# EAGLE schematic energia-2 (EAGLE 6.1)

## Sheet 1 of 4: Base
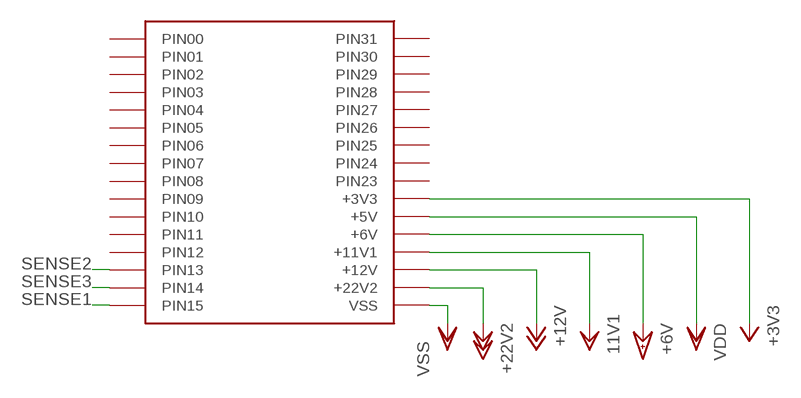
[diagram p0: schematic, sheet 1]

### Parts
U$1  BASE  [BASE]

### Nets
+3V3: U$1.PIN22(+3V3) ; also sheet 3
+6V: U$1.PIN20(+6V) ; also sheet 2
+11V1: U$1.PIN19(+11V1) ; supply symbol labelled 11V1 ; also sheet 3
+12V: U$1.PIN18(+12V) ; also sheet 2
+22V: U$1.PIN17(+22V2) ; supply symbol labelled +22V2 ; also sheet 2
SENSE1: U$1.PIN15 ; also sheet 4
SENSE2: U$1.PIN13 ; also sheet 4
SENSE3: U$1.PIN14 ; also sheet 4
VDD: U$1.PIN21(+5V) ; also sheet 3,4
VSS: U$1.PIN16(VSS) ; also sheet 2,3,4
Unconnected: U$1.PIN00 U$1.PIN01 U$1.PIN02 U$1.PIN03 U$1.PIN04 U$1.PIN05 U$1.PIN06 U$1.PIN07 U$1.PIN08 U$1.PIN09 U$1.PIN10 U$1.PIN11 U$1.PIN12 U$1.PIN23 U$1.PIN24 U$1.PIN25 U$1.PIN26 U$1.PIN27 U$1.PIN28 U$1.PIN29 U$1.PIN30 U$1.PIN31

## Sheet 2 of 4: Actuadores
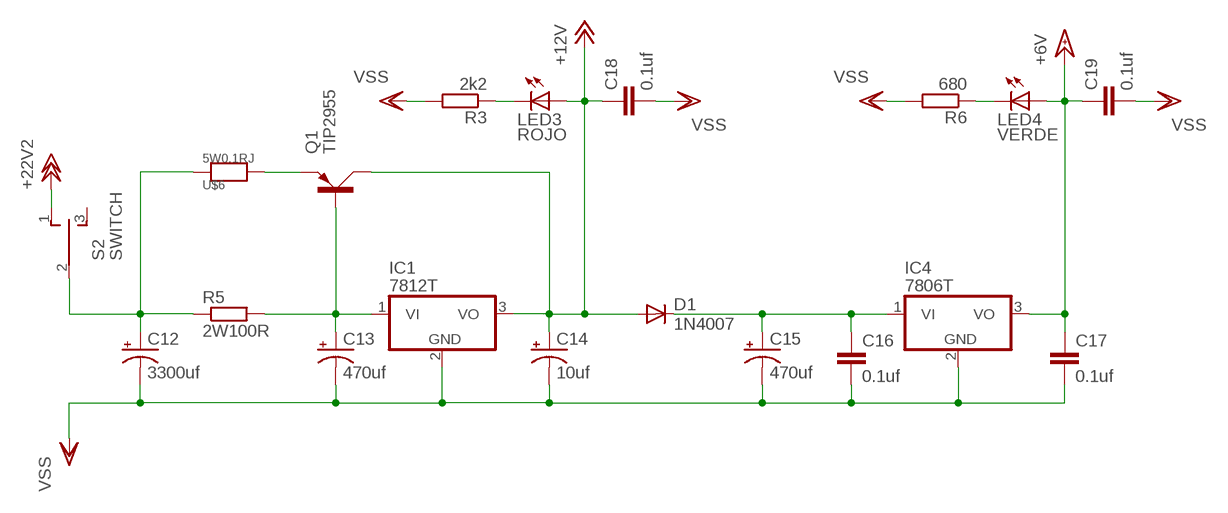
[diagram p1: schematic, sheet 2]

### Parts
C12  3300uf  CPOL-USE7.5-18  [E7,5-18]
C13  470uf  CPOL-USE3.5-8  [E3,5-8]
C14  10uf  CPOL-USE2.5-5  [E2,5-5]
C15  470uf  CPOL-USE3.5-8  [E3,5-8]
C16  0.1uf  C-EU050-024X044  [C050-024X044]
C17  0.1uf  C-EU050-024X044  [C050-024X044]
C18  0.1uf  C-EU050-024X044  [C050-024X044]
C19  0.1uf  C-EU050-024X044  [C050-024X044]
D1  1N4007  1N4004  [DO41-10]
IC1  7812T  [TO220H]
IC4  7806T  [TO220H]
LED3  ROJO  LED3MM  [LED3MM]
LED4  VERDE  LED3MM  [LED3MM]
Q1  TIP2955  [TOP3AV]
R3  2k2  R-EU_0204/5  [0204/5]
R5  2W100R  R-EU_0411/12  [0411/12]
R6  680  R-EU_0204/5  [0204/5]
S2  SWITCH  TL39YOSWITCH_2_ESTADOS  [TL3XYO]
U$6  5W0.1RJ  RESISTENCIA5WATT  [RES-22X10]

### Nets
+6V: C17.1 C19.1 IC4.3(VO) LED4.A ; also sheet 1
+12V: C14.+ C18.1 D1.A IC1.3(VO) LED3.A Q1.C ; also sheet 1
+22V: S2.1(O) ; supply symbol labelled +22V2 ; also sheet 1
N$3: LED3.K(C) R3.1
N$4: C12.+ R5.1 S2.2(P) U$6.P$1
N$7: Q1.E U$6.P$2
N$8: C13.+ IC1.1(VI) Q1.B R5.2
N$9: LED4.K(C) R6.1
N$13: C15.+ C16.1 D1.C IC4.1(VI)
VSS: C12.- C13.- C14.- C15.- C16.2 C17.2 C18.2 C19.2 IC1.2(GND) IC4.2(GND) R3.2 R6.2 ; also sheet 1,3,4
Unconnected: S2.3(S)

## Sheet 3 of 4: Energia Nucleo
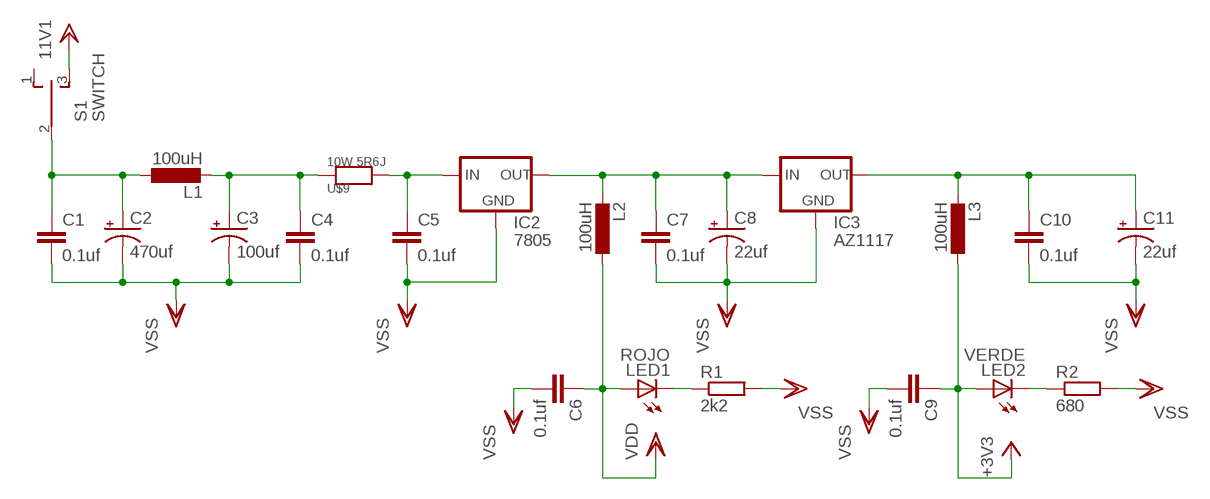
[diagram p2: schematic, sheet 3]

### Parts
C1  0.1uf  C-EU050-024X044  [C050-024X044]
C2  470uf  CPOL-USE2.5-7  [E2,5-7]
C3  100uf  CPOL-USE2.5-7  [E2,5-7]
C4  0.1uf  C-EU050-024X044  [C050-024X044]
C5  0.1uf  C-EU050-024X044  [C050-024X044]
C6  0.1uf  C-EU050-024X044  [C050-024X044]
C7  0.1uf  C-EU050-024X044  [C050-024X044]
C8  22uf  CPOL-USE2.5-7  [E2,5-7]
C9  0.1uf  C-EU050-024X044  [C050-024X044]
C10  0.1uf  C-EU050-024X044  [C050-024X044]
C11  22uf  CPOL-USE2.5-7  [E2,5-7]
IC2  7805  V_REG_78XX-TO-220  [TO-220-ALT]
IC3  AZ1117  V_REG_LD1117VXX  [78XXL]
L1  100uH  L-EUTFI0307  [TFI0307]
L2  100uH  L-EU0207/7  [0207/7]
L3  100uH  L-EU0207/7  [0207/7]
LED1  ROJO  LED3MM  [LED3MM]
LED2  VERDE  LED3MM  [LED3MM]
R1  2k2  R-EU_0204/5  [0204/5]
R2  680  R-EU_0204/5  [0204/5]
S1  SWITCH  TL39YOSWITCH_2_ESTADOS  [TL3XYO]
U$9  10W 5R6J  RESISTENCIA10W  [RES-49X10]

### Nets
+3V3: C9.1 L3.1 LED2.A ; also sheet 1
+11V1: S1.3(S) ; supply symbol labelled 11V1 ; also sheet 1
N$1: C1.1 C2.+ L1.1 S1.2(P)
N$10: C5.1 IC2.IN U$9.P$2
N$11: C3.+ C4.1 L1.2 U$9.P$1
N$12: C7.1 C8.+ IC2.OUT IC3.OUT(IN) L2.2
N$14: LED1.K(C) R1.1
N$17: C10.1 C11.+ IC3.GND(OUT) L3.2
N$18: LED2.K(C) R2.1
VDD: C6.1 L2.1 LED1.A ; also sheet 1,4
VSS: C1.2 C2.- C3.- C4.2 C5.2 C6.2 C7.2 C8.- C9.2 C10.2 C11.- IC2.GND IC3.IN(GND) R1.2 R2.2 ; also sheet 1,2,4
Unconnected: S1.1(O)

## Sheet 4 of 4: Monitor Lipo
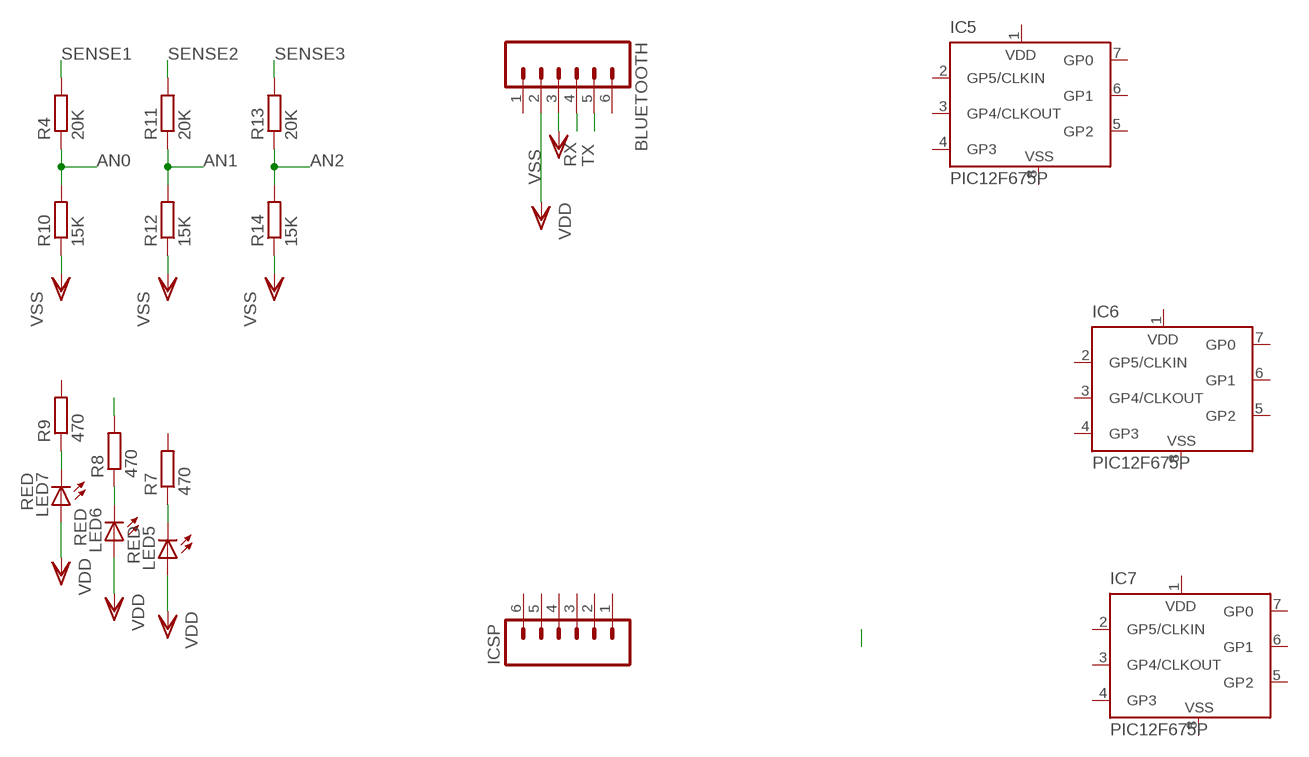
[diagram p3: schematic, sheet 4]

### Parts
BLUETOOTH  M06LONGPADS  [1X06_LONGPADS]
IC5  PIC12F675P  [DIL8]
IC6  PIC12F675P  [DIL8]
IC7  PIC12F675P  [DIL8]
ICSP  M06LONGPADS  [1X06_LONGPADS]
LED5  RED  LED3MM  [LED3MM]
LED6  RED  LED3MM  [LED3MM]
LED7  RED  LED3MM  [LED3MM]
R4  20K  R-EU_0204/5  [0204/5]
R7  470  R-EU_0204/5  [0204/5]
R8  470  R-EU_0204/5  [0204/5]
R9  470  R-EU_0204/5  [0204/5]
R10  15K  R-EU_0204/5  [0204/5]
R11  20K  R-EU_0204/5  [0204/5]
R12  15K  R-EU_0204/5  [0204/5]
R13  20K  R-EU_0204/5  [0204/5]
R14  15K  R-EU_0204/5  [0204/5]

### Nets
AN0: R4.1 R10.2
AN1: R11.1 R12.2
AN2: R13.1 R14.2
N$15: LED5.K(C) R7.1
N$16: LED7.K(C) R9.1
N$19: LED6.K(C) R8.1
N$21: R8.2
RX: BLUETOOTH.4
SENSE1: R4.2 ; also sheet 1
SENSE2: R11.2 ; also sheet 1
SENSE3: R13.2 ; also sheet 1
TX: BLUETOOTH.5
VDD: BLUETOOTH.2 LED5.A LED6.A LED7.A ; also sheet 1,3
VSS: BLUETOOTH.3 R10.1 R12.1 R14.1 ; also sheet 1,2,3
Unconnected: BLUETOOTH.1 BLUETOOTH.6 IC5.2(GP5/CLKIN) IC5.3(GP4/CLKOUT) IC5.4(GP3) IC5.5(GP2) IC5.6(GP1) IC5.7(GP0) IC6.2(GP5/CLKIN) IC6.3(GP4/CLKOUT) IC6.4(GP3) IC6.5(GP2) IC6.6(GP1) IC6.7(GP0) IC7.2(GP5/CLKIN) IC7.3(GP4/CLKOUT) IC7.4(GP3) IC7.5(GP2) IC7.6(GP1) IC7.7(GP0) ICSP.1 ICSP.2 ICSP.3 ICSP.4 ICSP.5 ICSP.6 R7.2 R9.2

## Power pins joined to a net without a drawn wire
VDD: IC5.1(VDD) IC6.1(VDD) IC7.1(VDD)
VSS: IC5.8(VSS) IC6.8(VSS) IC7.8(VSS)

## Library data of the parts
BLUETOOTH ICSP = SparkFun:M06: Header 6 Standard 6-pin 0.1" header. Use with straight break away headers (SKU : PRT-00116), right angle break away headers (PRT-00553), swiss pins (PRT-00743), machine pins (PRT-00117), and female headers (PRT-00115). Molex polarized connector foot print use with SKU : PRT-08094 with associated crimp pins and housings. NOTES ON THE VARIANTS LOCK and LOCK_LONGPADS... This footprint was designed to help hold the alignment of a through-hole component (i.e. 6-pin header) while soldering it into place. You may notice that each hole has been shifted either up or down by 0.005 of an inch from it's more standard position (which is a perfectly straight line). This slight alteration caused the pins (the squares in the middle) to touch the edges of the holes. Because they are alternating, it causes a "brace" to hold the component in place. 0.005 has proven to be the perfect amount of "off-center" position when using our standard breakaway headers. Although looks a little odd when you look at the bare footprint, once you have a header in there, the alteration is very hard to notice. Also, if you push a header all the way into place, it is covered up entirely on the bottom side. This idea of altering the position of holes to aid alignment will be further integrated into the Sparkfun Library for other footprints. It can help hold any component with 3 or more connection pins.
C1 C4-C7 C9 C10 C16-C19 = rcl:C-EU: CAPACITOR, European symbol
C2 C3 C8 C11-C15 = rcl:CPOL-US: POLARIZED CAPACITOR, American symbol
D1 = diode:1N4004: DIODE general purpose rectifier, 1 A
IC1 IC4 = adafruit:78*: Positive VOLTAGE REGULATOR Added bigger pads to the TO-92 package
IC2 = SparkFun:V_REG_78XX: Voltage Regulator Standard 7805 5V regulator. IGO (Input Ground Output). Spark Fun Electronics SKU : COM-00107
IC3 = SparkFun:V_REG_LD1117VXX: LD1117VXX voltage regulator. We carry the 3.3V version (COM-00526) in TO-220 package.
IC5-IC7 = microchip:PIC12F6*: Data Sheet 8-Pin FLASH-Based 8-Bit CMOS Microcontrollers Source: http://www.microchip.com .. 41190c.pdf; MF: MICROCHIP; MPN: PIC12F675-E/P; OC_FARNELL: 9759018; OC_NEWARK: 92C4340
L1-L3 = rcl:L-EU: INDUCTOR, European symbol
LED1-LED7 = adafruit:LED: LED OSRAM: - CHIPLED LG R971, LG N971, LY N971, LG Q971, LY Q971, LO R971, LY R971 LH N974, LH R974 LS Q976, LO Q976, LY Q976 LO Q996 - Hyper CHIPLED LW Q18S LB Q993, LB Q99A, LB R99A - SideLED LS A670, LO A670, LY A670, LG A670, LP A670 LB A673, LV A673, LT A673, LW A673 LH A674 LY A675 LS A676, LA A676, LO A676, LY A676, LW A676 LS A679, LY A679, LG A679 - Hyper Micro SIDELED® LS Y876, LA Y876, LO Y876, LY Y876 LT Y87S - SmartLED LW L88C, LW L88S LB L89C, LB L89S, LG L890 LS L89K, LO L89K, LY L89K LS L896, LA L896, LO L896, LY L896 - TOPLED LS T670, LO T670, LY T670, LG T670, LP T670 LSG T670, LSP T670, LSY T670, LOP T670, LYG T670 LG T671, LOG T671, LSG T671 LB T673, LV T673, LT T673, LW T673 LH T674 LS T676, LA T676, LO T676, LY T676, LB T676, LH T676, LSB T676, LW T676 LB T67C, LV T67C, LT T67C, LS T67K, LO T67K, LY T67K, LW E67C LS E67B, LA E67B, LO E67B, LY E67B, LB E67C, LV E67C, LT E67C LW T67C LS T679, LY T679, LG T679 LS T770, LO T770, LY T770, LG T770, LP T770 LB T773, LV T773, LT T773, LW T773 LH T774 LS E675, LA E675, LY E675, LS T675 LS T776, LA T776, LO T776, LY T776, LB T776 LHGB T686 LT T68C, LB T68C - Hyper Mini TOPLED® LB M676 - Mini TOPLED Santana® LG M470 LS M47K, LO M47K, LY M47K Source: http://www.osram.convergy.de/
Q1 = transistor-power:TIP2955: PNP TRANSISTOR
R1-R14 = rcl:R-EU_: RESISTOR, European symbol
S1 S2 = aasanchez:TL39YO: TINY SWITCH ON OFF ON Source: http://www2.produktinfo.conrad.com/datenblaetter/700000-724999/705152-da-01-de-Subminiaturschalter_TL_36YO.pdf
U$1 = aasanchez:BASE
U$6 U$9 = aasanchez:RESISTENCIA